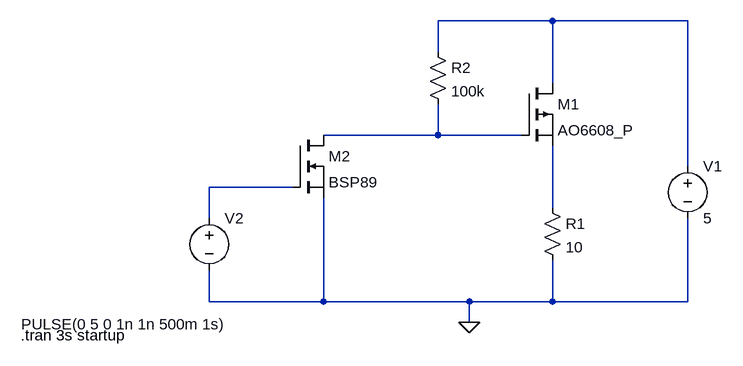
[diagram p0: schematic Draft2.asc]
Draft2.asc, the LTspice schematic file:
Version 4
SHEET 1 880 680
WIRE 208 -16 32 -16
WIRE 416 -16 208 -16
WIRE 32 32 32 -16
WIRE 208 80 208 -16
WIRE 32 160 32 112
WIRE 32 160 -144 160
WIRE 160 160 32 160
WIRE 416 208 416 -16
WIRE -192 240 -320 240
WIRE 208 272 208 176
WIRE -320 288 -320 240
WIRE -320 416 -320 368
WIRE -144 416 -144 256
WIRE -144 416 -320 416
WIRE 80 416 -144 416
WIRE 208 416 208 352
WIRE 208 416 80 416
WIRE 416 416 416 288
WIRE 416 416 208 416
WIRE 80 448 80 416
FLAG 80 448 0
SYMBOL res 192 256 R0
SYMATTR InstName R1
SYMATTR Value 10
SYMBOL voltage 416 192 R0
WINDOW 123 0 0 Left 0
WINDOW 39 0 0 Left 0
SYMATTR InstName V1
SYMATTR Value 5
SYMBOL voltage -320 272 R0
WINDOW 3 -289 179 Left 2
WINDOW 123 0 0 Left 0
WINDOW 39 0 0 Left 0
SYMATTR InstName V2
SYMATTR Value PULSE(0 5 0 1n 1n 500m 1s)
SYMBOL pmos 160 80 R0
SYMATTR InstName M1
SYMATTR Value AO6608_P
SYMBOL nmos -192 160 R0
SYMATTR InstName M2
SYMATTR Value BSP89
SYMBOL res 16 16 R0
SYMATTR InstName R2
SYMATTR Value 100k
TEXT -610 468 Left 2 !.tran 3s startup

The netlist it stands for:
* Draft2.asc
R1 N004 0 10
V1 N001 0 5
V2 N003 0 PULSE(0 5 0 1n 1n 500m 1s)
M1 N001 N002 N004 N004 AO6608_P
M2 N002 N003 0 0 BSP89
R2 N001 N002 100k
.model NMOS NMOS
.model PMOS PMOS
.lib standard.mos
.tran 3s startup
.backanno
.end